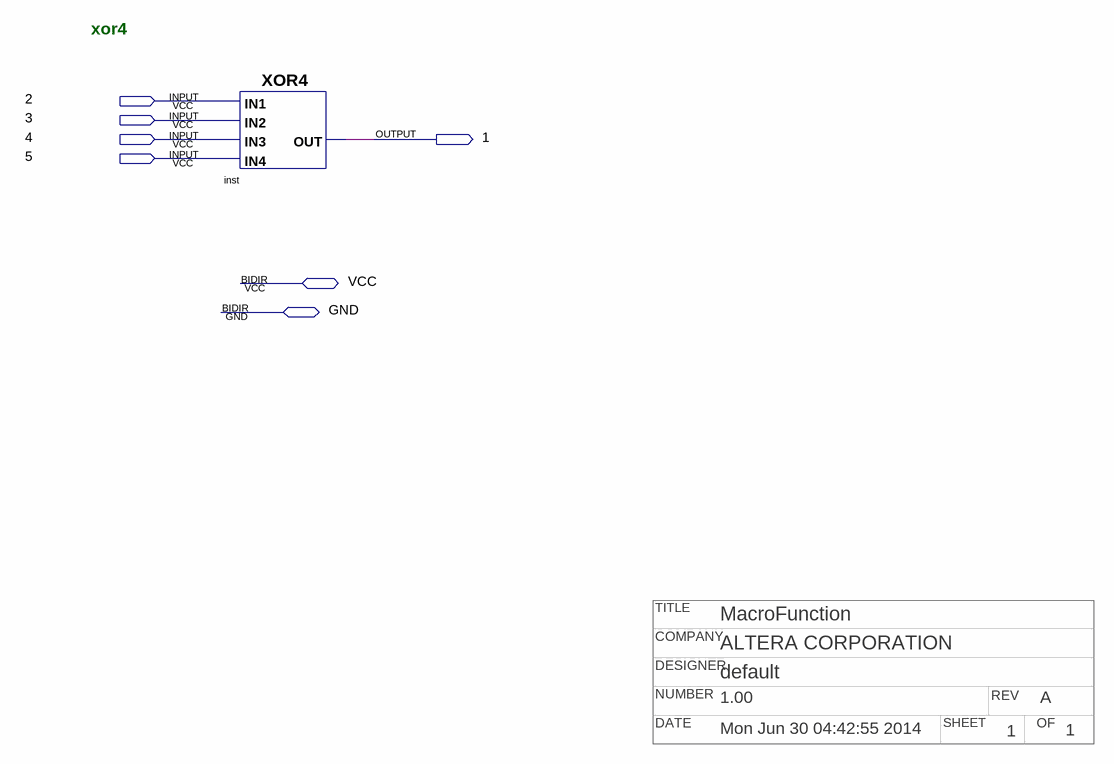
[diagram p0: schematic sheet]
// Quartus schematic npxor4.bdf as structural Verilog: 1 symbols, 7 pins
// Title block: TITLE: MacroFunction; COMPANY: ALTERA CORPORATION; DESIGNER: default; NUMBER: 1.00; REV: A; DATE: Mon Jun 30 04:42:55 2014; SHEET: 1; OF: 1
module npxor4 (
  input  \2 ,
  input  \3 ,
  input  \4 ,
  input  \5 ,
  inout  VCC,
  inout  GND,
  output \1 
);

  XOR4 inst (.IN3(\4 ), .IN4(\5 ), .IN2(\3 ), .IN1(\2 ), .OUT(\1 ));

  // Notes on the sheet:
  //   xor4
endmodule
